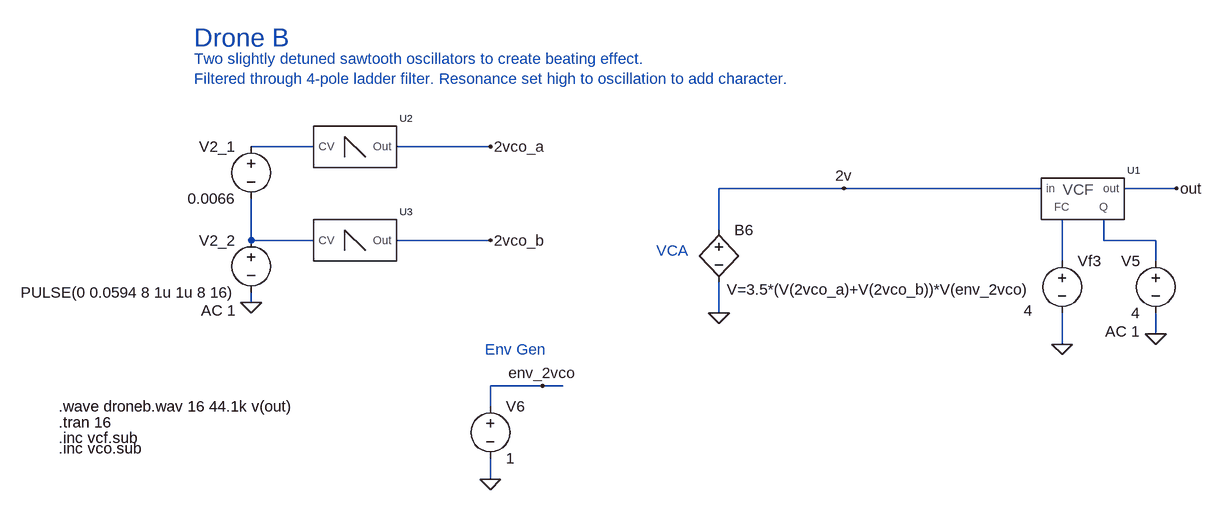
[diagram p0: schematic droneb.asc]
droneb.asc, the LTspice schematic file:
Version 4
SHEET 1 1536 5468
WIRE -1616 224 -1712 224
WIRE -1344 224 -1488 224
WIRE -800 288 -992 288
WIRE -496 288 -800 288
WIRE -288 288 -368 288
WIRE -992 352 -992 288
WIRE -1712 368 -1712 304
WIRE -1616 368 -1712 368
WIRE -1344 368 -1488 368
WIRE -400 368 -400 336
WIRE -320 368 -400 368
WIRE -464 400 -464 336
WIRE -320 400 -320 368
WIRE -1712 464 -1712 448
WIRE -992 480 -992 432
WIRE -320 512 -320 480
WIRE -464 528 -464 480
WIRE -1264 592 -1344 592
WIRE -1232 592 -1264 592
WIRE -1344 624 -1344 592
WIRE -1344 736 -1344 704
FLAG -992 480 0
FLAG -1344 224 2vco_a
FLAG -800 288 2v
FLAG -1712 464 0
FLAG -1344 368 2vco_b
FLAG -1344 736 0
FLAG -1264 592 env_2vco
FLAG -288 288 out
FLAG -320 512 0
FLAG -464 528 0
SYMBOL bv -992 336 R0
WINDOW 3 12 108 Left 2
SYMATTR Value V=3.5*(V(2vco_a)+V(2vco_b))*V(env_2vco)
SYMATTR InstName B6
SYMBOL voltage -1712 352 M0
WINDOW 123 24 124 Left 2
WINDOW 39 0 0 Left 2
SYMATTR Value2 AC 1
SYMATTR InstName V2_2
SYMATTR Value PULSE(0 0.0594 8 1u 1u 8 16)
SYMBOL voltage -1712 208 M0
WINDOW 123 24 124 Left 2
WINDOW 39 0 0 Left 2
SYMATTR InstName V2_1
SYMATTR Value 0.0066
SYMBOL voltage -464 384 R0
WINDOW 123 0 0 Left 0
WINDOW 39 0 0 Left 0
WINDOW 3 -59 92 Left 2
SYMATTR Value 4
SYMATTR InstName Vf3
SYMBOL voltage -1344 608 R0
WINDOW 123 0 0 Left 0
WINDOW 39 0 0 Left 0
SYMATTR InstName V6
SYMATTR Value 1
SYMBOL vcf -432 256 R0
SYMATTR InstName U1
SYMBOL voltage -320 384 M0
WINDOW 123 24 124 Left 2
WINDOW 39 0 0 Left 2
SYMATTR Value2 AC 1
SYMATTR InstName V5
SYMATTR Value 4
SYMBOL vco -1552 176 R0
SYMATTR InstName U2
SYMBOL vco -1552 320 R0
SYMATTR InstName U3
TEXT -2008 648 Left 2 !.tran 16
TEXT -2008 624 Left 2 !.wave droneb.wav 16 44.1k v(out)
TEXT -1088 384 Left 2 ;VCA
TEXT -1800 56 Left 4 ;Drone B
TEXT -1800 88 Left 2 ;Two slightly detuned sawtooth oscillators to create beating effect.\nFiltered through 4-pole ladder filter. Resonance set high to oscillation to add character.
TEXT -1352 536 Left 2 ;Env Gen
TEXT -2008 672 Left 2 !.inc vcf.sub
TEXT -2008 688 Left 2 !.inc vco.sub

The netlist it stands for:
* droneb.asc
B6 2v 0 V=3.5*(V(2vco_a)+V(2vco_b))*V(env_2vco)
V2_2 N002 0 PULSE(0 0.0594 8 1u 1u 8 16) AC 1
V2_1 N001 N002 0.0066
Vf3 N004 0 4
V6 env_2vco 0 1
XU1 2v out N004 N003 vcf  ; pins in out FC Q
V5 N003 0 4 AC 1
XU2 N001 2vco_a vco  ; pins CV Out
XU3 N002 2vco_b vco  ; pins CV Out
.tran 16
.wave droneb.wav 16 44.1k v(out)
* VCA
* Drone B
* Two slightly detuned sawtooth oscillators to create beating effect.
* Filtered through 4-pole ladder filter. Resonance set high to oscillation to add character.
* Env Gen
.inc vcf.sub
.inc vco.sub
.backanno
.end